# EAGLE design sensor (EAGLE 6.5.0)
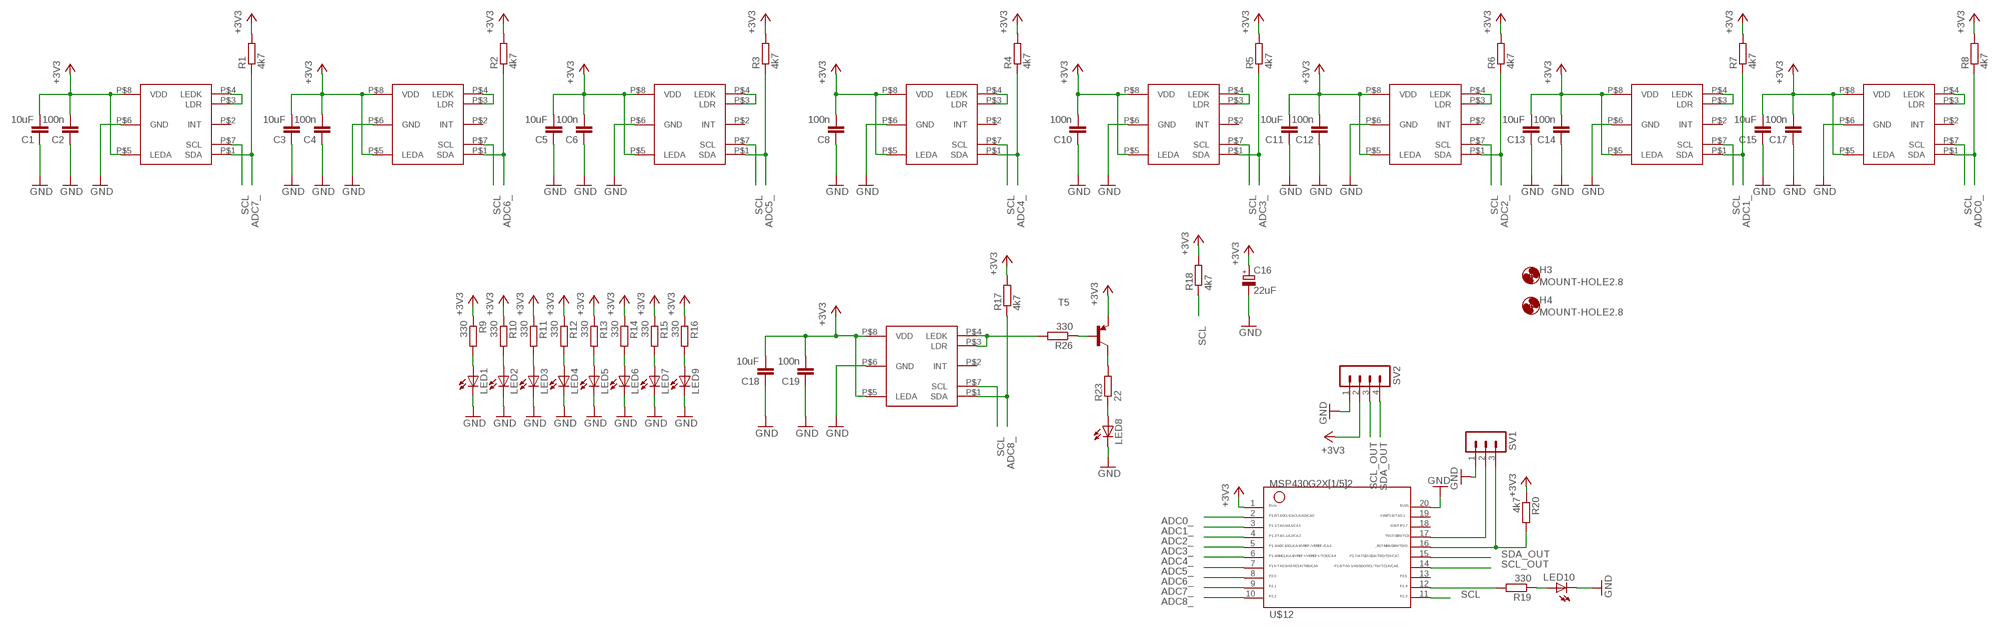
[diagram p0: schematic, sheet 1]

## Parts
C1  10uF  C-EUC0805  [C0805]
C2  100n  C-EUC0805  [C0805]
C3  10uF  C-EUC0805  [C0805]
C4  100n  C-EUC0805  [C0805]
C5  10uF  C-EUC0805  [C0805]
C6  100n  C-EUC0805  [C0805]
C8  100n  C-EUC0805  [C0805]
C10  100n  C-EUC0805  [C0805]
C11  10uF  C-EUC0805  [C0805]
C12  100n  C-EUC0805  [C0805]
C13  10uF  C-EUC0805  [C0805]
C14  100n  C-EUC0805  [C0805]
C15  10uF  C-EUC0805  [C0805]
C16  22uF  CPOL-EU153CLV-0505  [153CLV-0505]
C17  100n  C-EUC0805  [C0805]
C18  10uF  C-EUC0805  [C0805]
C19  100n  C-EUC0805  [C0805]
H3  MOUNT-HOLE2.8  [2,8]
H4  MOUNT-HOLE2.8  [2,8]
LED1  LEDCHIPLED_1206  [CHIPLED_1206]
LED2  LEDCHIPLED_1206  [CHIPLED_1206]
LED3  LEDCHIPLED_1206  [CHIPLED_1206]
LED4  LEDCHIPLED_1206  [CHIPLED_1206]
LED5  LEDCHIPLED_1206  [CHIPLED_1206]
LED6  LEDCHIPLED_1206  [CHIPLED_1206]
LED7  LEDCHIPLED_1206  [CHIPLED_1206]
LED8  LED5MM  [LED5MM]
LED9  LEDCHIPLED_1206  [CHIPLED_1206]
LED10  LEDCHIPLED_1206  [CHIPLED_1206]
R1  4k7  R-EU_M0805  [M0805]
R2  4k7  R-EU_M0805  [M0805]
R3  4k7  R-EU_M0805  [M0805]
R4  4k7  R-EU_M0805  [M0805]
R5  4k7  R-EU_M0805  [M0805]
R6  4k7  R-EU_M0805  [M0805]
R7  4k7  R-EU_M0805  [M0805]
R8  4k7  R-EU_M0805  [M0805]
R9  330  R-EU_M0805  [M0805]
R10  330  R-EU_M0805  [M0805]
R11  330  R-EU_M0805  [M0805]
R12  330  R-EU_M0805  [M0805]
R13  330  R-EU_M0805  [M0805]
R14  330  R-EU_M0805  [M0805]
R15  330  R-EU_M0805  [M0805]
R16  330  R-EU_M0805  [M0805]
R17  4k7  R-EU_M0805  [M0805]
R18  4k7  R-EU_M0805  [M0805]
R19  330  R-EU_M0805  [M0805]
R20  4k7  R-EU_M0805  [M0805]
R23  22  R-EU_M0805  [M0805]
R26  330  R-EU_M0805  [M0805]
SV1  MA03-1  [MA03-1]
SV2  MA04-1  [MA04-1]
T5  BC857A-PNP-SOT23-BEC  [SOT23-BEC]
U$1  APDS9950  [APDS9950]
U$2  APDS9950_EDGE  [APDS9950_EDGE]
U$4  APDS9950  [APDS9950]
U$5  APDS9950  [APDS9950]
U$6  APDS9950  [APDS9950]
U$7  APDS9950  [APDS9950]
U$8  APDS9950  [APDS9950]
U$9  APDS9950  [APDS9950]
U$10  APDS9950  [APDS9950]
U$12  G2X[1/5]2---PW20  [PW20]

## Nets
+3V3: C1.2 C2.2 C3.2 C4.2 C5.2 C6.2 C8.2 C10.2 C11.2 C12.2 C13.2 C14.2 C15.2 C16.+ C17.2 C18.2 C19.2 R1.2 R2.2 R3.2 R4.2 R5.2 R6.2 R7.2 R8.2 R9.1 R10.1 R11.1 R12.1 R13.1 R14.1 R15.1 R16.1 R17.2 R18.2 R20.1 SV2.2 T5.E U$1.P$5(LEDA) U$1.P$8(VDD) U$2.P$5(LEDA) U$2.P$8(VDD) U$4.P$5(LEDA) U$4.P$8(VDD) U$5.P$5(LEDA) U$5.P$8(VDD) U$6.P$5(LEDA) U$6.P$8(VDD) U$7.P$5(LEDA) U$7.P$8(VDD) U$8.P$5(LEDA) U$8.P$8(VDD) U$9.P$5(LEDA) U$9.P$8(VDD) U$10.P$5(LEDA) U$10.P$8(VDD) U$12.1
ADC0_: R8.1 U$10.P$1(SDA) U$12.2
ADC1_: R7.1 U$9.P$1(SDA) U$12.3
ADC2_: R6.1 U$8.P$1(SDA) U$12.4
ADC3_: R5.1 U$7.P$1(SDA) U$12.5
ADC4_: R4.1 U$6.P$1(SDA) U$12.6
ADC5_: R3.1 U$5.P$1(SDA) U$12.7
ADC6_: R2.1 U$4.P$1(SDA) U$12.8
ADC7_: R1.1 U$1.P$1(SDA) U$12.9
ADC8_: R17.1 U$2.P$1(SDA) U$12.10
GND: C1.1 C2.1 C3.1 C4.1 C5.1 C6.1 C8.1 C10.1 C11.1 C12.1 C13.1 C14.1 C15.1 C16.- C17.1 C18.1 C19.1 LED1.C LED2.C LED3.C LED4.C LED5.C LED6.C LED7.C LED8.K(C) LED9.C LED10.C SV1.1 SV2.1 U$1.P$6(GND) U$2.P$6(GND) U$4.P$6(GND) U$5.P$6(GND) U$6.P$6(GND) U$7.P$6(GND) U$8.P$6(GND) U$9.P$6(GND) U$10.P$6(GND) U$12.20
N$1: R23.2 T5.C
N$2: U$4.P$3(LDR) U$4.P$4(LEDK)
N$3: LED1.A R9.2
N$4: U$1.P$3(LDR) U$1.P$4(LEDK)
N$5: LED2.A R10.2
N$6: LED3.A R11.2
N$7: LED4.A R12.2
N$8: LED5.A R13.2
N$9: U$5.P$3(LDR) U$5.P$4(LEDK)
N$13: LED6.A R14.2
N$14: LED7.A R15.2
N$15: U$6.P$3(LDR) U$6.P$4(LEDK)
N$16: LED9.A R16.2
N$17: R19.2 U$12.12
N$18: LED10.A R19.1
N$19: R26.2 U$2.P$3(LDR) U$2.P$4(LEDK)
N$20: U$7.P$3(LDR) U$7.P$4(LEDK)
N$21: SV1.2 U$12.17
N$22: R20.2 SV1.3 U$12.16
N$24: U$8.P$3(LDR) U$8.P$4(LEDK)
N$27: U$9.P$3(LDR) U$9.P$4(LEDK)
N$28: LED8.A R23.1
N$31: U$10.P$3(LDR) U$10.P$4(LEDK)
N$32: R26.1 T5.B
SCL: R18.1 U$1.P$7(SCL) U$2.P$7(SCL) U$4.P$7(SCL) U$5.P$7(SCL) U$6.P$7(SCL) U$7.P$7(SCL) U$8.P$7(SCL) U$9.P$7(SCL) U$10.P$7(SCL) U$12.11
SCL_OUT: SV2.3 U$12.14
SDA_OUT: SV2.4 U$12.15
Unconnected: U$1.P$2(INT) U$2.P$2(INT) U$4.P$2(INT) U$5.P$2(INT) U$6.P$2(INT) U$7.P$2(INT) U$8.P$2(INT) U$9.P$2(INT) U$10.P$2(INT) U$12.13 U$12.18 U$12.19

## Library data of the parts
C1-C6 C8 C10-C15 C17-C19 = resistor:C-EU: CAPACITOR, European symbol
C16 = resistor:CPOL-EU: POLARIZED CAPACITOR, European symbol
H3 H4 = holes:MOUNT-HOLE: MOUNTING HOLE with drill center marker
LED1-LED7 LED9 LED10 = my_parts:LED: LED OSRAM: - CHIPLED LG R971, LG N971, LY N971, LG Q971, LY Q971, LO R971, LY R971 LH N974, LH R974 LS Q976, LO Q976, LY Q976 LO Q996 - Hyper CHIPLED LW Q18S LB Q993, LB Q99A, LB R99A - SideLED LS A670, LO A670, LY A670, LG A670, LP A670 LB A673, LV A673, LT A673, LW A673 LH A674 LY A675 LS A676, LA A676, LO A676, LY A676, LW A676 LS A679, LY A679, LG A679 - Hyper Micro SIDELED® LS Y876, LA Y876, LO Y876, LY Y876 LT Y87S - SmartLED LW L88C, LW L88S LB L89C, LB L89S, LG L890 LS L89K, LO L89K, LY L89K LS L896, LA L896, LO L896, LY L896 - TOPLED LS T670, LO T670, LY T670, LG T670, LP T670 LSG T670, LSP T670, LSY T670, LOP T670, LYG T670 LG T671, LOG T671, LSG T671 LB T673, LV T673, LT T673, LW T673 LH T674 LS T676, LA T676, LO T676, LY T676, LB T676, LH T676, LSB T676, LW T676 LB T67C, LV T67C, LT T67C, LS T67K, LO T67K, LY T67K, LW E67C LS E67B, LA E67B, LO E67B, LY E67B, LB E67C, LV E67C, LT E67C LW T67C LS T679, LY T679, LG T679 LS T770, LO T770, LY T770, LG T770, LP T770 LB T773, LV T773, LT T773, LW T773 LH T774 LS E675, LA E675, LY E675, LS T675 LS T776, LA T776, LO T776, LY T776, LB T776 LHGB T686 LT T68C, LB T68C - Hyper Mini TOPLED® LB M676 - Mini TOPLED Santana® LG M470 LS M47K, LO M47K, LY M47K Source: http://www.osram.convergy.de LUXEON: - LUMILED® LXK2-PW12-R00, LXK2-PW12-S00, LXK2-PW14-U00, LXK2-PW14-V00 LXK2-PM12-R00, LXK2-PM12-S00, LXK2-PM14-U00 LXK2-PE12-Q00, LXK2-PE12-R00, LXK2-PE12-S00, LXK2-PE14-T00, LXK2-PE14-U00 LXK2-PB12-K00, LXK2-PB12-L00, LXK2-PB12-M00, LXK2-PB14-N00, LXK2-PB14-P00, LXK2-PB14-Q00 LXK2-PR12-L00, LXK2-PR12-M00, LXK2-PR14-Q00, LXK2-PR14-R00 LXK2-PD12-Q00, LXK2-PD12-R00, LXK2-PD12-S00 LXK2-PH12-R00, LXK2-PH12-S00 LXK2-PL12-P00, LXK2-PL12-Q00, LXK2-PL12-R00 Source: www.luxeon.com KINGBRIGHT: KA-3528ASYC Source: www.kingbright.com
LED8 = led:LED: LED OSRAM: - CHIPLED LG R971, LG N971, LY N971, LG Q971, LY Q971, LO R971, LY R971 LH N974, LH R974 LS Q976, LO Q976, LY Q976 LO Q996 - Hyper CHIPLED LW Q18S LB Q993, LB Q99A, LB R99A - SideLED LS A670, LO A670, LY A670, LG A670, LP A670 LB A673, LV A673, LT A673, LW A673 LH A674 LY A675 LS A676, LA A676, LO A676, LY A676, LW A676 LS A679, LY A679, LG A679 - Hyper Micro SIDELED® LS Y876, LA Y876, LO Y876, LY Y876 LT Y87S - SmartLED LW L88C, LW L88S LB L89C, LB L89S, LG L890 LS L89K, LO L89K, LY L89K LS L896, LA L896, LO L896, LY L896 - TOPLED LS T670, LO T670, LY T670, LG T670, LP T670 LSG T670, LSP T670, LSY T670, LOP T670, LYG T670 LG T671, LOG T671, LSG T671 LB T673, LV T673, LT T673, LW T673 LH T674 LS T676, LA T676, LO T676, LY T676, LB T676, LH T676, LSB T676, LW T676 LB T67C, LV T67C, LT T67C, LS T67K, LO T67K, LY T67K, LW E67C LS E67B, LA E67B, LO E67B, LY E67B, LB E67C, LV E67C, LT E67C LW T67C LS T679, LY T679, LG T679 LS T770, LO T770, LY T770, LG T770, LP T770 LB T773, LV T773, LT T773, LW T773 LH T774 LS E675, LA E675, LY E675, LS T675 LS T776, LA T776, LO T776, LY T776, LB T776 LHGB T686 LT T68C, LB T68C - Hyper Mini TOPLED® LB M676 - Mini TOPLED Santana® LG M470 LS M47K, LO M47K, LY M47K Source: http://www.osram.convergy.de LUXEON: - LUMILED® LXK2-PW12-R00, LXK2-PW12-S00, LXK2-PW14-U00, LXK2-PW14-V00 LXK2-PM12-R00, LXK2-PM12-S00, LXK2-PM14-U00 LXK2-PE12-Q00, LXK2-PE12-R00, LXK2-PE12-S00, LXK2-PE14-T00, LXK2-PE14-U00 LXK2-PB12-K00, LXK2-PB12-L00, LXK2-PB12-M00, LXK2-PB14-N00, LXK2-PB14-P00, LXK2-PB14-Q00 LXK2-PR12-L00, LXK2-PR12-M00, LXK2-PR14-Q00, LXK2-PR14-R00 LXK2-PD12-Q00, LXK2-PD12-R00, LXK2-PD12-S00 LXK2-PH12-R00, LXK2-PH12-S00 LXK2-PL12-P00, LXK2-PL12-Q00, LXK2-PL12-R00 Source: www.luxeon.com KINGBRIGHT: KA-3528ASYC Source: www.kingbright.com
R1-R20 R23 R26 = resistor:R-EU_: RESISTOR, European symbol
SV1 = con-lstb:MA03-1: PIN HEADER; OC_FARNELL: unknown; OC_NEWARK: unknown
SV2 = con-lstb:MA04-1: PIN HEADER; OC_FARNELL: unknown; OC_NEWARK: unknown
T5 = transistor:*-PNP-: PNP Transistror
U$1 U$4-U$10 = my_parts:APDS9950
U$2 = my_parts:APDS9950_EDGE
U$12 = my_parts:G2X[1/5]2---PW20: MSP430G2X[1/5]2 MSP430G2x52, MSP430G2x12 TSSOP (PW) 20 Pin Package http://focus.ti.com/docs/prod/folders/print/msp430g2452.html

## Board
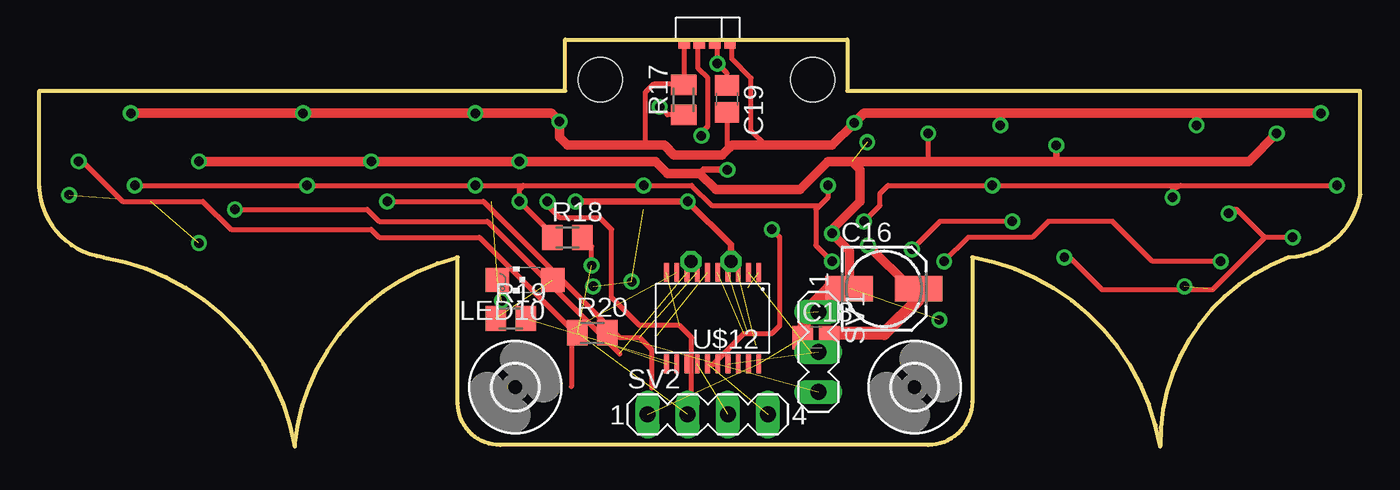
[diagram p1: board, top side]
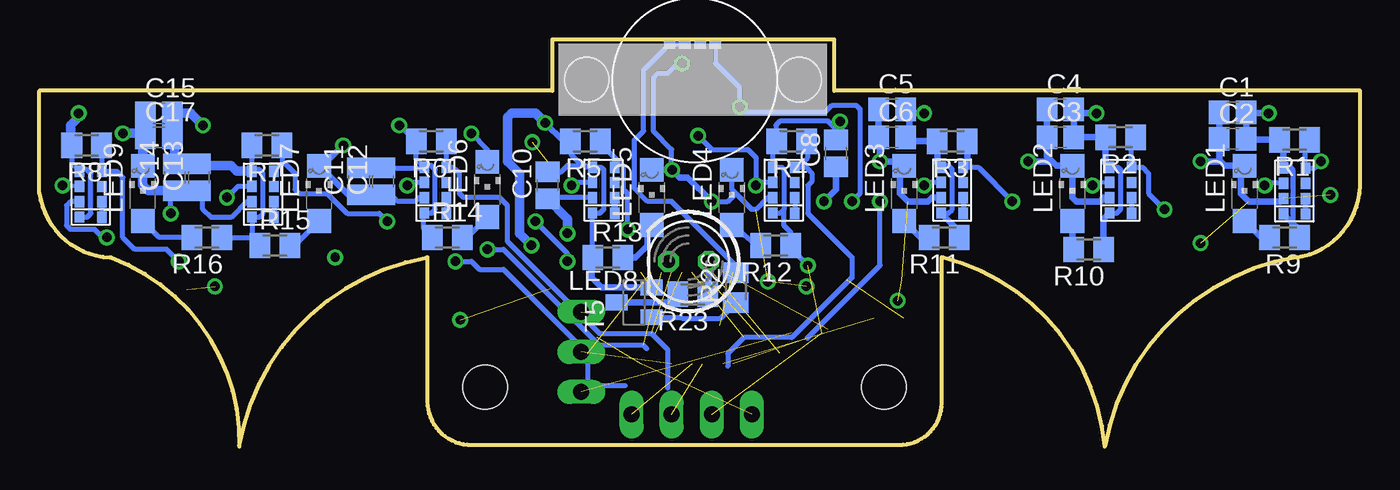
[diagram p2: board, bottom side, seen from below]

Size 83.72 x 25.81 mm. Coordinates in mm from the lower left corner, seen from the top.
Outline: 0,22.55 33.33,22.55 33.33,25.81 51.21,25.81 51.21,22.55 83.72,22.55 83.72,16.05 arc-80 79.25,11.99 79.17,11.99 arc71 71.04,0 arc71 59.16,11.99 59.13,11.99 59.13,2.84 arc-90 56.34,0.1 29.21,0.1 arc-90 26.52,2.74 26.52,11.99 26.47,11.99 arc71 16.18,0 arc71 4.06,11.99 arc-80 0,16.46 0,22.55
Copper layers (1*16): Top 0.035mm / dielectric 1.5mm / Bottom 0.035mm
Design rules "default *": minimum track width 10mil, minimum drill 24mil, track to track 10mil, track to pad 10mil, pad to pad 10mil, via to via 10mil, smd to smd 10mil, copper to edge 40mil, drill to drill 8mil, minimum pad ring 10mil, minimum via ring 8mil, stop-mask expansion 4mil, vias tented up to drill 0mil, thermal gap 10mil

### Footprints (pad centres in the part's own frame; a part is rotated, then mirrored left to right if it is on the bottom)
C0805 = smd 1.3 x 1.5: 1 -0.85,0; 2 0.85,0
153CLV-0505 = smd 3 x 1.6: + 2.2,0; - -2.2,0
2,8 = hole 2.8: 0,0
CHIPLED_1206 = smd 1.5 x 1.5: A 0,-1.75; C 0,1.75
LED5MM = drill 0.813 octagon: A -1.27,0; K 1.27,0
M0805 = smd 1.3 x 1.6: 1 -0.95,0; 2 0.95,0
MA03-1 = drill 1.016 long: 1 -2.54,0; 2 0,0; 3 2.54,0
MA04-1 = drill 1.016 long: 1 -3.81,0; 2 -1.27,0; 3 1.27,0; 4 3.81,0
SOT23-BEC = smd 1 x 1.4: B -0.95,-1.1; C 0,1.1; E 0.95,-1.1
APDS9950 = smd 0.6 x 0.72: P$1 0.7,1.4; P$2 0.7,0.43; P$3 0.7,-0.54; P$4 0.7,-1.51; P$5 -0.7,-1.5; P$6 -0.7,-0.53; P$7 -0.7,0.44; P$8 -0.7,1.41
APDS9950_EDGE = smd 0.6 x 0.72 bottom: P$1 -0.9,1.5; P$2 -0.9,0.53; P$3 -0.9,-0.44; P$4 -0.9,-1.41 | smd 0.6 x 0.72: P$5 -0.9,-1.41; P$6 -0.9,-0.44; P$7 -0.9,0.53; P$8 -0.9,1.5
BALL_3/8 = hole 2.8: -6.35,0; 7.112,0
PW20 = smd 0.3 x 1.2: 1 -2.925,-2.9; 2 -2.275,-2.9; 3 -1.625,-2.9; 4 -0.975,-2.9; 5 -0.325,-2.9; 6 0.325,-2.9; 7 0.975,-2.9; 8 1.625,-2.9; 9 2.275,-2.9; 10 2.925,-2.9; 11 2.925,2.9; 12 2.275,2.9; 13 1.625,2.9; 14 0.975,2.9; 15 0.325,2.9; 16 -0.325,2.9; 17 -0.975,2.9; 18 -1.625,2.9; 19 -2.275,2.9; 20 -2.925,2.9

### Placement (x,y rotation side)
C1  8.08,21.18 0 bottom
C2  8.08,19.51 0 bottom
C3  19,19.61 0 bottom
C4  19,21.39 0 bottom
C5  29.67,21.39 0 bottom
C6  29.67,19.61 0 bottom
C8  33.22,18.59 90 bottom
C10  51.51,16.56 90 bottom
C11  63.45,16.81 90 bottom
C12  61.93,16.81 90 bottom
C13  73.61,17.07 90 bottom
C14  75.13,17.07 90 bottom
C15  76.15,21.13 0 bottom
C16  53.54,10.01 0 top
C17  76.15,19.61 0 bottom
C18  49.23,6.91 0 top
C19  43.59,22.05 270 top
H3  30.18,3.76 0 top
H4  55.47,3.76 0 top
LED1  7.32,16.05 0 bottom
LED2  18.24,16.05 0 bottom
LED3  28.91,16.05 0 bottom
LED4  39.83,15.8 0 bottom
LED5  44.91,15.8 0 bottom
LED6  55.32,16.31 0 bottom
LED7  65.99,16.05 0 bottom
LED8  42.57,11.73 180 bottom
LED9  77.17,16.05 0 bottom
LED10  30.78,10.57 90 top
R1  4.17,19.46 180 bottom
R2  15.19,19.61 180 bottom
R3  25.86,19.35 180 bottom
R4  36.02,19.35 180 bottom
R5  49.12,19.35 180 bottom
R6  58.88,19.35 180 bottom
R7  69.29,19.1 180 bottom
R8  80.72,19.1 180 bottom
R9  4.78,13.26 180 bottom
R10  17.22,12.5 180 bottom
R11  26.37,13.26 180 bottom
R12  37.03,12.75 180 bottom
R13  47.7,11.99 0 bottom
R14  57.86,13.26 0 bottom
R15  68.78,12.75 0 bottom
R16  73.1,13.26 180 bottom
R17  40.84,22 90 top
R18  33.48,13.26 0 top
R19  29.87,8.13 0 top
R20  35.05,7.21 0 top
R23  42.32,9.65 180 bottom
R26  39.57,10.06 90 bottom
SV1  49.38,5.99 270 top
SV2  42.37,2.03 0 top
T5  46.02,9.14 90 bottom
U$1  4.17,16.26 0 bottom
U$2  42.37,26.42 90 top
U$3  [BALL_3/8]  42.67,23.27 0 bottom
U$4  15.19,16.31 0 bottom
U$5  25.86,16.31 0 bottom
U$6  36.53,16.31 0 bottom
U$7  47.96,16.31 0 bottom
U$8  58.62,16.31 0 bottom
U$9  69.55,16.05 0 bottom
U$10  80.47,16.05 0 bottom
U$12  42.67,8.13 180 top

### Tracks (layer width: path | path; a pad name or v marks a point on that pad's centre or on a via)
+3V3  (via drill 0.6)  (3 unrouted)
  Top 0.305: 55.58,9.84 55.58,9.53 55.74,9.36 | v35,11.48 35,12.68 R18.2 | U$2.P$8 40.87,22.97 | C19.2 43.59,19.1 43.74,18.95 | 40.87,22.97 38.92,22.97 38.41,22.45 38.41,19.41 38.71,19.1 | 50.24,19.1 46.03,19.1 45.11,20.01 45.11,23.37 43.89,24.59 43.89,25.4 U$2.P$5 | 40.87,22.97 R17.2
  Top 0.61: v5.79,21.13 v16.71,21.13 v27.64,21.13 32.46,21.13 v32.97,20.62 32.97,19.61 33.48,19.1 38.71,19.1 39.62,19.1 40.23,18.49 43.28,18.49 43.74,18.95 43.89,19.1 50.24,19.1 v51.66,20.52 52.27,21.13 60.91,21.13 | 60.91,21.13 73.36,21.13 | 73.36,21.13 v81.23,21.13 | v60.91,20.37 60.91,21.13 | v73.36,20.37 73.36,21.13 | C16.+ 55.27,10.01 v52.53,12.75
  Top 0.813: 55.58,9.84 C16.+ | 50.29,6.69 C18.2 50.33,7.16 53.54,7.16 55.74,9.36
  Bottom 0.305: U$5.P$5 26.09,14.81 25.86,15.04 25.86,17.58 26.11,17.83 26.44,17.83 U$5.P$8 | U$1.P$8 4.36,17.67 4.27,17.58 4.27,14.16 4.07,13.96 | U$4.P$8 15.33,17.72 15.19,17.58 15.19,15.04 15.44,14.78 15.87,14.78 U$4.P$5 | 36.53,15.04 36.53,17.58 36.67,17.72 U$6.P$8 37.23,19.1 R4.2 37.03,19.42 37.03,20.37 36.78,20.62 33.73,20.62 33.22,20.12 C8.2 | 36.53,15.04 36.78,14.78 37.2,14.78 U$6.P$5 | 36.53,15.04 36.53,14.02 36.08,13.58 R12.1 36.08,12.56 v35,11.48 | U$8.P$8 59.21,17.83 58.88,17.83 58.62,17.58 58.62,15.04 58.85,14.81 U$8.P$5 59.39,14.74 59.39,13.83 R14.1 58.62,12.75 | U$8.P$8 59.83,18.22 R6.2 | U$8.P$8 59.38,17.66 C12.2 C11.2 | U$7.P$8 48.1,17.72 47.96,17.58 47.96,15.04 48.21,14.78 48.63,14.78 U$7.P$5 R13.1 | U$7.P$8 49.11,17.72 49.23,17.83 | C10.2 50.66,17.41 50.24,17.83 49.33,17.83 | 49.23,17.83 48.77,17.83 U$7.P$8 | R7.2 U$9.P$8 70.13,17.58 69.8,17.58 69.55,17.32 69.55,14.78 69.78,14.55 U$9.P$5 70.25,13.26 R15.1 70.24,13.26 R16.1 | C15.2 75.3,20.62 C17.2 | U$10.P$5 80.7,14.55 80.47,14.78 80.47,17.32 80.72,17.58 81.05,17.58 U$10.P$8 81.67,17.97 R8.2 | 49.23,17.83 49.33,17.83 | 49.33,17.83 49.99,18.49 49.99,19.57 R5.2 50.5,19.35
  Bottom 0.406: U$1.P$8 4.87,19.46 R1.2 7.18,19.46 C2.2 | 7.02,19.71 C2.2 | 4.84,14.78 U$1.P$5 4.07,13.96 3.83,13.72 R9.1 | C1.2 C2.2 | U$4.P$8 16.14,17.97 R2.2 C3.2 C4.2 17.9,21.13 v16.71,21.13 | R10.1 16.27,14.42 U$4.P$5 | C2.2 7.23,20.97 7.06,21.13 v5.79,21.13 | 28.56,21.13 28.56,19.86 C6.2 28.56,19.35 R3.2 26.81,17.97 U$5.P$8 | v27.64,21.13 28.56,21.13 | 28.56,21.13 C5.2 | R11.1 25.42,13.66 U$5.P$5 | 50.5,19.35 v51.66,20.52 | T5.E 48.09,10.09 48.72,10.72 48.72,11.92 R13.1 | v60.91,20.37 60.84,20.37 R6.2
  Bottom 0.61: v81.23,21.13 81.23,20.88 81.74,20.37 81.74,19.17 R8.2 | R6.2 59.89,19.35 | C15.2 74.12,21.13 v73.36,20.37 | 75.3,20.62 75.13,20.46 C14.2 C13.2 72.76,17.83 71.58,17.83 71.21,17.46 U$9.P$8 | v52.53,12.75 53.29,13.51 53.29,17.32 54.05,18.08 54.05,20.88 53.8,21.13 52.27,21.13 v51.66,20.52 | v32.97,20.62 32.97,19.7 C8.2
ADC0_  (via drill 0.6)  (1 unrouted)
  Top 0.305: v74.88,11.73 70.56,11.73 68.02,14.27 63.96,14.27 62.94,13.26 58.88,13.26 v57.35,11.73
  Bottom 0.305: R8.1 U$10.P$1 78.82,17.45 78.44,17.07 78.44,13.26 77.67,12.5 75.64,12.5 v74.88,11.73 | v57.35,11.73 56.34,11.73 55.83,11.23 54.31,11.23 48.97,5.89 48.97,4.11 48.72,3.86 46.58,3.86
ADC1_  (via drill 0.6)  (1 unrouted)
  Top 0.305: v61.67,14.27 57.1,14.27 v55.32,12.5
  Bottom 0.305: R7.1 68.34,17.96 | 68.34,17.96 U$9.P$1 | 68.34,17.96 68.15,17.96 67.51,17.32 67.51,16.31 67.26,16.05 65.48,16.05 64.21,14.78 62.18,14.78 v61.67,14.27 | 45.21,6.2 45.42,6.4 48.21,6.4 54.31,12.5 v55.32,12.5
ADC2_  (1 unrouted)
  Bottom 0.305: U$8.P$1 R6.1 | U$8.P$1 57.48,17.71 | 43.89,3.71 43.89,6.15 44.91,7.16 48.21,7.16 54.05,13 54.05,15.29 54.56,15.8 56.85,15.8 57.1,16.05 57.1,17.32 57.35,17.58 57.79,17.58 U$8.P$1
ADC3_  (via drill 0.6)  (1 unrouted)
  Top 0.305: 42.67,5.18 44.65,7.16 46.43,7.16 46.94,7.67 46.94,13.26 v46.43,13.77
  Bottom 0.305: 47.26,18.34 U$7.P$1 47.13,17.83 | v46.43,13.77 46.43,16.05 46.69,16.31 46.69,17.77 47.26,18.34 | R5.1 48.17,19.26 47.26,18.34
ADC4_  (1 unrouted)
  Bottom 0.305: R4.1 35,19.29 35,18.34 35.63,17.71 U$6.P$1 35.13,17.71 34.75,17.32 34.75,16.81 35,16.56 35,14.78 32.21,11.99 32.21,10.72 36.02,6.91 39.07,6.91 40.08,5.89 40.08,5.08
ADC5_  (via drill 0.6)  (1 unrouted)
  Top 0.305: 38.81,3.71 38.81,6.15 38.05,6.91 36.78,6.91 28.14,15.54 v22.05,15.54
  Bottom 0.305: 24.91,17.96 U$5.P$1 24.21,17.71 v22.05,15.54
  Bottom 0.406: R3.1 24.91,17.96
ADC6_  (via drill 0.6)  (1 unrouted)
  Top 0.305: v12.4,15.04 20.78,15.04 21.54,14.27 28.4,14.27 36.78,5.89 36.78,5.84
  Bottom 0.305: R2.1 14.49,19.36 U$4.P$1 13.8,17.71 13.41,17.32 13.41,16.05 v12.4,15.04
ADC7_  (via drill 0.6)  (1 unrouted)
  Top 0.305: v2.49,18.08 2.74,18.08 5.28,15.54 10.36,15.54 12.14,13.77 21.03,13.77 21.54,13.26 27.89,13.26 33.73,7.42 33.73,3.81
  Bottom 0.305: R1.1 3.47,19.46 U$1.P$1 2.92,17.66 v2.49,18.08
ADC8_  (via drill 0.6)  (1 unrouted)
  Top 0.305: 40.49,2.49 41.35,3.35 41.35,6.91 40.59,7.67 38.05,7.67 36.27,9.45 36.27,13.77 35.51,14.53 32.97,14.53 32.21,15.29 v32.21,15.54 | R17.1 39.81,21.05 v39.32,21.54
  Bottom 0.254: U$2.P$1 40.87,24.31
  Bottom 0.305: v32.21,15.54 31.7,16.05 31.7,21.39 31.95,21.64 33.48,21.64 33.88,21.23 39.01,21.23 v39.32,21.54 39.32,22.76 40.87,24.31
GND  (via drill 0.6)  (12 unrouted)
  Top 0.305: v79.45,13.26 77.67,13.26 | 77.67,13.26 75.9,15.04 75.64,15.04 v75.39,14.78 | v56.34,19.86 56.34,18.08 | v64.97,11.99 65.33,11.99 67.36,9.96 74.37,9.96 77.67,13.26 | U$2.P$6 42.98,25.35 v42.98,24.28 43.59,23.67 C19.1
  Top 0.406: v33.99,15.54 v41.1,15.54 43.84,12.8 LED8.K | v64.47,19.1 64.47,18.08 | v43.61,17.55 42.09,17.55 41.86,17.32
  Top 0.61: v10.11,18.08 v21.03,18.08 v30.43,18.08 39.07,18.08 39.83,17.32 41.86,17.32 42.88,16.31 48.21,16.31 49.99,18.08 51.51,18.08 | v78.44,19.86 76.66,18.08 64.47,18.08 56.34,18.08 51.51,18.08 | C16.- 51.34,12.41 v50.24,13.51 50.24,13.77 52.02,15.54 52.02,17.58 51.51,18.08
  Top 0.813: 51,9.67 C16.- 50.04,10.01 48.46,8.43 48.46,7 C18.1
  Bottom 0.305: v41.1,15.54 40.08,15.54 39.57,16.05 | C11.1 C12.1 61.23,15.78 61,15.54 59.89,15.54 59.66,15.78 U$8.P$6 | 39.57,16.05 39.83,16.31 LED4.C 39.83,17.83 | U$7.P$6 51.7,15.78 C10.1 | U$9.P$6 70.58,15.52 71.58,14.53 72.85,14.53 73.36,15.04 73.36,15.96 C13.1 | U$10.P$6 81.76,15.52 81.99,15.29 81.99,14.02 81.74,13.77 80.21,13.77 79.71,13.26 v79.45,13.26 | v75.39,14.78 75.39,15.96 C14.1 | LED6.C 55.32,18.85 v56.34,19.86 | 39.57,16.05 38.56,15.04 38.3,15.04 37.56,15.78 U$6.P$6 | 43.64,17.58 43.64,18.85 44.81,20.01 44.81,23.37 44.5,23.67 43.89,23.67 43.28,24.28 v42.98,24.28
  Bottom 0.406: C1.1 C2.1 8.93,18.17 | 8.93,18.17 8.59,17.83 7.34,17.83 LED1.C 7.57,17.55 7.57,16.05 7.06,15.54 5.05,15.54 U$1.P$6 | C4.1 C3.1 19.85,18.43 19.51,18.08 | 19.51,18.08 19.25,17.83 18.27,17.83 LED2.C 18.24,15.8 17.98,15.54 16.46,15.54 16.23,15.78 U$4.P$6 | v21.03,18.08 19.51,18.08 | v10.11,18.08 9.02,18.08 8.93,18.17 | C5.1 C6.1 30.43,19.52 v30.43,18.08 29.19,18.08 LED3.C 29.16,17.55 29.16,16.05 28.65,15.54 27.38,15.54 27.15,15.78 U$5.P$6 | 32.88,18.08 C8.1 33.22,16.31 v33.99,15.54 | v64.47,19.1 65.76,17.8 LED7.C 64.15,15.96 C11.1 | LED5.C v43.61,17.55 | v43.61,17.55 43.13,17.07 42.62,17.07 v41.1,15.54 | v43.61,17.55 43.64,17.58
  Bottom 0.61: 77,20.12 C17.1 77.17,19.44 LED9.C 77.17,16.56 76.82,16.22 C14.1 C13.1 | 77,20.12 C15.1 | v78.44,19.86 77.25,19.86 77,20.12 | v50.24,13.51 50.24,14.44 C10.1
  other vias: 10.11,12.9 1.88,15.95 29.31,9.25 37.54,10.46 35.1,10.16 57.05,8.03 52.48,19.3 72.59,10.16
N$1
  Bottom 0.406: T5.C 43.77,9.14 R23.2
N$2
  Bottom 0.305: U$4.P$3 U$4.P$4
N$3
  Bottom 0.406: R9.2 6.27,13.26 LED1.A
N$4
  Bottom 0.305: U$1.P$3 U$1.P$4
N$5
  Bottom 0.406: LED2.A 18.24,12.56 R10.2
N$6
  Bottom 0.406: R11.2 27.86,13.26 LED3.A
N$7
  Bottom 0.305: R12.2 38.28,12.75 LED4.A
N$8
  Bottom 0.406: R13.2 45.92,11.99 45.16,12.75 45.16,13.79 LED5.A
N$9
  Bottom 0.305: U$5.P$3 U$5.P$4
N$13
  Bottom 0.305: R14.2 56.62,13.26 LED6.A
N$14
  Bottom 0.305: R15.2 67.54,12.75 LED7.A
N$15
  Bottom 0.305: U$6.P$3 U$6.P$4
N$16
  Bottom 0.305: R16.2 76.12,13.26 LED9.A
N$17  (1 unrouted)
N$18  (1 unrouted)
N$19
  Bottom 0.305: R26.2 39.27,11.18 43.64,15.54 45.16,15.54 46.03,16.41 46.03,19.41 45.42,20.01 45.42,23.88 U$2.P$4 U$2.P$3
N$20
  Bottom 0.406: U$7.P$3 U$7.P$4
N$21  (1 unrouted)
N$22  (2 unrouted)
N$24
  Bottom 0.305: U$8.P$3 U$8.P$4
N$27
  Bottom 0.305: U$9.P$3 U$9.P$4
N$28
  Bottom 0.406: LED8.A 41.3,9.72 R23.1
N$31
  Bottom 0.305: U$10.P$3 U$10.P$4
N$32
  Bottom 0.305: T5.B 43.04,8.19 42.98,8.13 40.55,8.13 R26.1
SCL  (via drill 0.6)  (1 unrouted)
  Top 0.305: v27.64,16.56 27.38,16.56 | v6.05,16.56 v16.97,16.56 v27.64,16.56 | 30.68,16.56 30.43,16.31 v30.43,15.54 32.02,13.95 R18.1 | v27.64,16.56 30.68,16.56 | 30.68,16.56 v38.3,16.56 41.35,16.56 42.62,15.29 49.48,15.29 | 72.34,16.56 v60.4,16.56 53.8,16.56 53.29,16.05 53.29,15.29 v52.27,14.27 | 72.34,16.56 v82.25,16.56 | v71.83,15.8 71.83,16.31 72.34,16.56 | 49.48,15.29 49.99,15.8 v49.99,16.56 | 49.48,15.29 49.23,15.04 49.23,12.75 v50.24,11.73 | v41.96,19.71 41.96,19.91 42.37,20.32 42.37,23.37 41.76,23.98 41.76,25.44 U$2.P$7
  Bottom 0.254: U$4.P$7 16.78,16.75 v16.97,16.56 | v82.25,16.56 81.24,16.56 U$10.P$7
  Bottom 0.305: U$1.P$7 5.91,16.7 v6.05,16.56 | U$5.P$7 27.45,16.75 v27.64,16.56 | 35.05,6.86 30.43,11.48 v30.43,15.54 | U$6.P$7 38.12,16.75 v38.3,16.56 38.3,18.34 38.81,18.85 41.1,18.85 v41.96,19.71 | U$9.P$7 71.14,16.49 v71.83,15.8 | U$8.P$7 60.22,16.75 v60.4,16.56 | U$7.P$7 49.8,16.75 v49.99,16.56 | v50.24,11.73 50.24,12.24 v52.27,14.27
SCL_OUT  (1 unrouted)
SDA_OUT  (1 unrouted)